# Altium schematic sheet schem2.SchDoc
size A; SheetNumber: 2; SheetTotal: 2
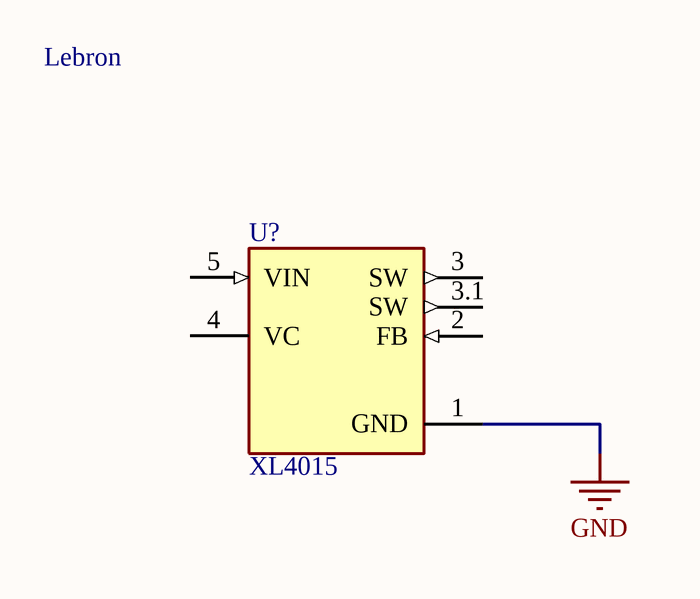
[diagram p0: schem2.SchDoc]

## Parts
U?  XL4015  [CONV_XL4015]

## Nets
GND: U?.1(GND)

Not connected (* = marked no-connect by the designer): U? 2(FB) 3(SW) 3.1(SW) 4(VC) 5(VIN)

## Notes on the sheet
- Lebron

## Library data of the parts
U? = XL4015: 5A 180KHz 36V Buck DC to DC Converter; Price: None; MP: XL4015; Value: *; Availability: Unavailable; Package: None